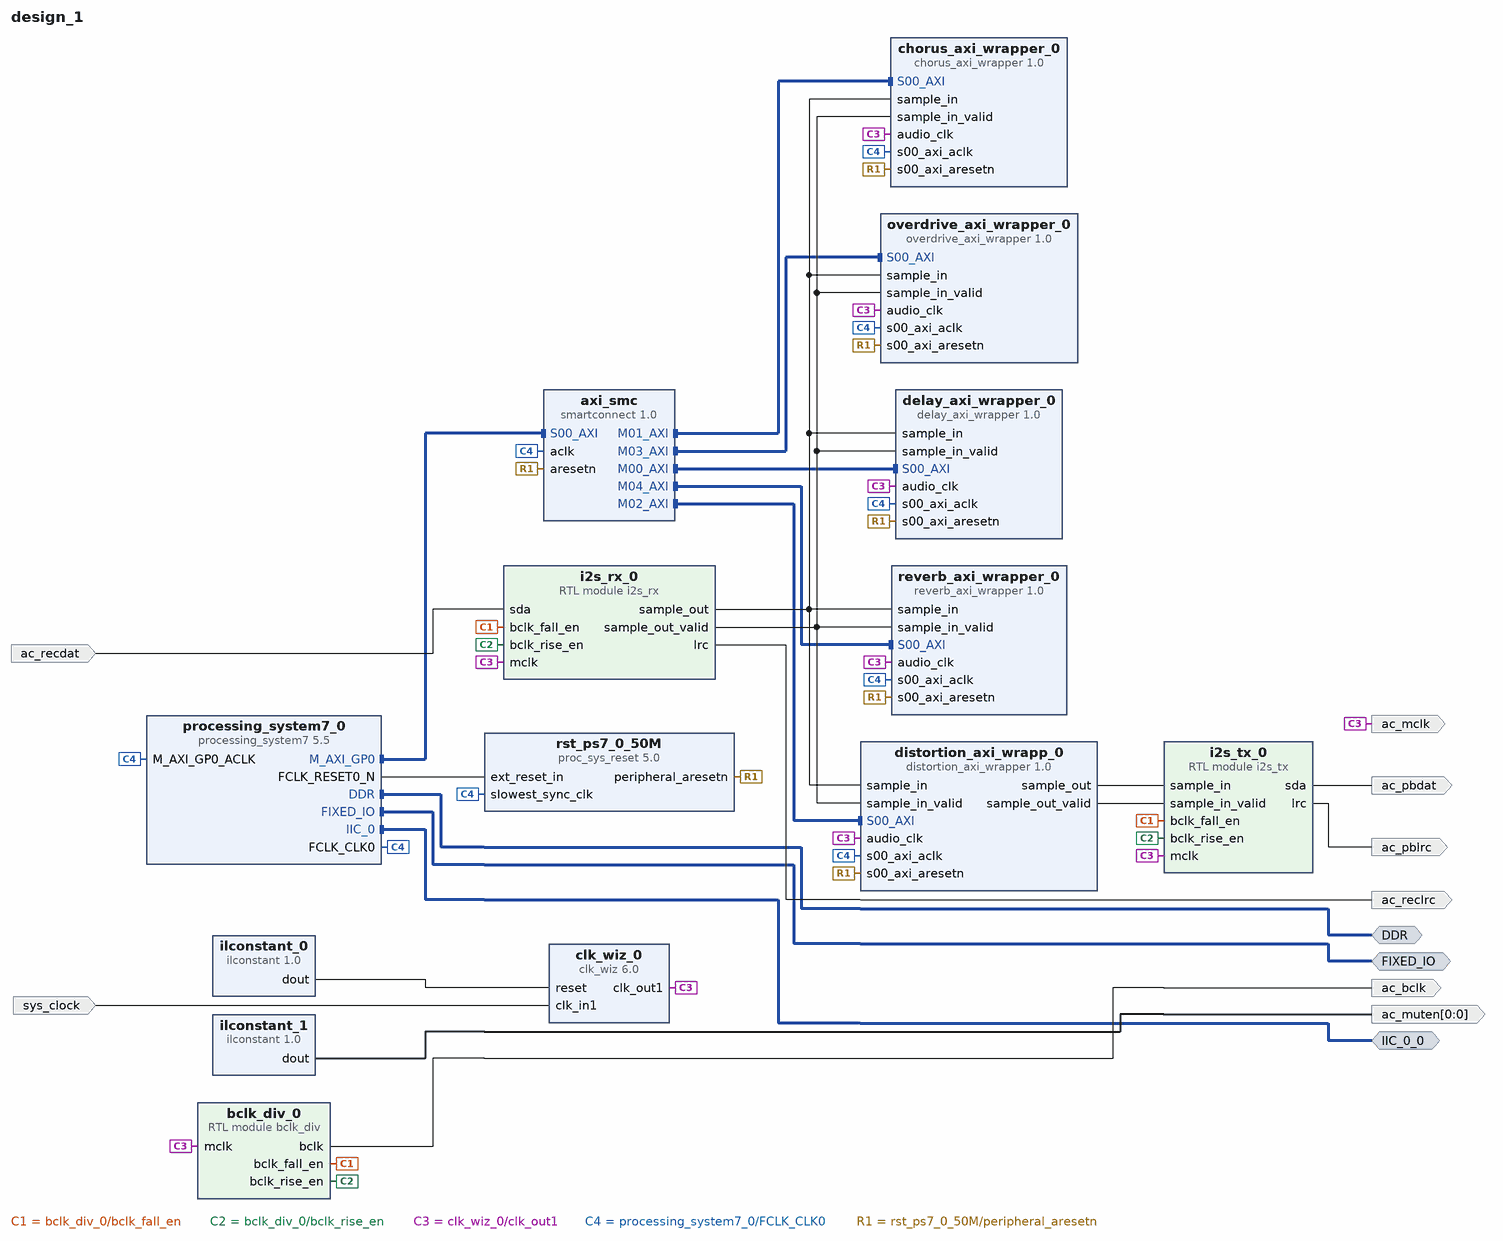
[diagram p0: block diagram of the top level]
# Vivado block design design_1, xc7z010clg400-1, Vivado 2026.1
create_bd_design design_1

create_bd_intf_port -mode Master -vlnv xilinx.com:interface:ddrx_rtl:1.0 DDR
create_bd_intf_port -mode Master -vlnv xilinx.com:display_processing_system7:fixedio_rtl:1.0 FIXED_IO
create_bd_intf_port -mode Master -vlnv xilinx.com:interface:iic_rtl:1.0 IIC_0_0
create_bd_port -dir I -type clk sys_clock
set_property -dict {CONFIG.FREQ_HZ 125000000 CONFIG.PHASE 0.0} [get_bd_ports sys_clock]
create_bd_port -dir O ac_bclk
create_bd_port -dir O ac_pbdat
create_bd_port -dir O ac_pblrc
create_bd_port -dir I ac_recdat
create_bd_port -dir O ac_reclrc
create_bd_port -dir O -type clk ac_mclk
create_bd_port -dir O -from 0 -to 0 ac_muten

create_bd_cell -type ip -vlnv xilinx.com:ip:processing_system7:5.5 processing_system7_0
set_property -dict [list \
  CONFIG.PCW_APU_PERIPHERAL_FREQMHZ 666.666666 \
  CONFIG.PCW_ENET0_ENET0_IO {MIO 16 .. 27} \
  CONFIG.PCW_ENET0_GRP_MDIO_ENABLE 1 \
  CONFIG.PCW_ENET0_GRP_MDIO_IO {MIO 52 .. 53} \
  CONFIG.PCW_ENET0_PERIPHERAL_ENABLE 1 \
  CONFIG.PCW_ENET0_RESET_ENABLE 0 \
  CONFIG.PCW_ENET_RESET_ENABLE 1 \
  CONFIG.PCW_ENET_RESET_SELECT {Share reset pin} \
  CONFIG.PCW_GPIO_MIO_GPIO_ENABLE 1 \
  CONFIG.PCW_GPIO_MIO_GPIO_IO MIO \
  CONFIG.PCW_I2C0_I2C0_IO EMIO \
  CONFIG.PCW_I2C0_PERIPHERAL_ENABLE 1 \
  CONFIG.PCW_I2C_PERIPHERAL_FREQMHZ 111.111115 \
  CONFIG.PCW_I2C_RESET_ENABLE 1 \
  CONFIG.PCW_I2C_RESET_SELECT {Share reset pin} \
  CONFIG.PCW_PRESET_BANK1_VOLTAGE {LVCMOS 1.8V} \
  CONFIG.PCW_QSPI_GRP_FBCLK_ENABLE 1 \
  CONFIG.PCW_QSPI_GRP_FBCLK_IO {MIO 8} \
  CONFIG.PCW_QSPI_GRP_SINGLE_SS_ENABLE 1 \
  CONFIG.PCW_QSPI_GRP_SINGLE_SS_IO {MIO 1 .. 6} \
  CONFIG.PCW_QSPI_PERIPHERAL_ENABLE 1 \
  CONFIG.PCW_QSPI_QSPI_IO {MIO 1 .. 6} \
  CONFIG.PCW_SD0_GRP_CD_ENABLE 1 \
  CONFIG.PCW_SD0_GRP_CD_IO {MIO 47} \
  CONFIG.PCW_SD0_GRP_WP_ENABLE 0 \
  CONFIG.PCW_SD0_PERIPHERAL_ENABLE 1 \
  CONFIG.PCW_SD0_SD0_IO {MIO 40 .. 45} \
  CONFIG.PCW_SDIO_PERIPHERAL_FREQMHZ 50 \
  CONFIG.PCW_SINGLE_QSPI_DATA_MODE x4 \
  CONFIG.PCW_UART1_PERIPHERAL_ENABLE 1 \
  CONFIG.PCW_UART1_UART1_IO {MIO 48 .. 49} \
  CONFIG.PCW_UART_PERIPHERAL_FREQMHZ 100 \
  CONFIG.PCW_UIPARAM_DDR_FREQ_MHZ 533.333333 \
  CONFIG.PCW_UIPARAM_DDR_MEMORY_TYPE {DDR 3 (Low Voltage)} \
  CONFIG.PCW_UIPARAM_DDR_PARTNO {MT41K256M16 RE-125} \
  CONFIG.PCW_USB0_PERIPHERAL_ENABLE 1 \
  CONFIG.PCW_USB0_RESET_ENABLE 1 \
  CONFIG.PCW_USB0_RESET_IO {MIO 46} \
  CONFIG.PCW_USB0_USB0_IO {MIO 28 .. 39} \
  CONFIG.PCW_USB_RESET_ENABLE 1 \
  CONFIG.PCW_USB_RESET_SELECT {Share reset pin} \
] [get_bd_cells processing_system7_0]
# 299 more settings of processing_system7_0 are not shown: defaults, MIO pin electricals, DDR timing, and values the tool derives
create_bd_cell -type ip -vlnv xilinx.com:ip:clk_wiz:6.0 clk_wiz_0
set_property -dict [list \
  CONFIG.CLKOUT1_JITTER 473.813 \
  CONFIG.CLKOUT1_PHASE_ERROR 351.816 \
  CONFIG.CLKOUT1_REQUESTED_OUT_FREQ 12.288 \
  CONFIG.CLK_IN1_BOARD_INTERFACE sys_clock \
  CONFIG.MMCM_CLKFBOUT_MULT_F 42.750 \
  CONFIG.MMCM_CLKOUT0_DIVIDE_F 62.125 \
  CONFIG.MMCM_DIVCLK_DIVIDE 7 \
  CONFIG.USE_BOARD_FLOW true \
] [get_bd_cells clk_wiz_0]
create_bd_cell -type module -reference bclk_div bclk_div_0
create_bd_cell -type module -reference i2s_rx i2s_rx_0
create_bd_cell -type module -reference i2s_tx i2s_tx_0
create_bd_cell -type inline_hdl -vlnv xilinx.com:inline_hdl:ilconstant:1.0 ilconstant_0
set_property -dict {CONFIG.CONST_VAL 0} [get_bd_cells ilconstant_0]
create_bd_cell -type inline_hdl -vlnv xilinx.com:inline_hdl:ilconstant:1.0 ilconstant_1
create_bd_cell -type ip -vlnv xilinx.com:user:delay_axi_wrapper:1.0 delay_axi_wrapper_0
create_bd_cell -type ip -vlnv xilinx.com:ip:smartconnect:1.0 axi_smc
set_property -dict {CONFIG.NUM_MI 5 CONFIG.NUM_SI 1} [get_bd_cells axi_smc]
create_bd_cell -type ip -vlnv xilinx.com:ip:proc_sys_reset:5.0 rst_ps7_0_50M
create_bd_cell -type ip -vlnv xilinx.com:user:chorus_axi_wrapper:1.0 chorus_axi_wrapper_0
create_bd_cell -type ip -vlnv xilinx.com:user:reverb_axi_wrapper:1.0 reverb_axi_wrapper_0
create_bd_cell -type ip -vlnv xilinx.com:user:overdrive_axi_wrapper:1.0 overdrive_axi_wrapper_0
create_bd_cell -type ip -vlnv xilinx.com:user:distortion_axi_wrapper:1.0 distortion_axi_wrapp_0

# ---- connections ----

connect_bd_intf_net [get_bd_intf_pins axi_smc/M00_AXI] [get_bd_intf_pins delay_axi_wrapper_0/S00_AXI]
connect_bd_intf_net [get_bd_intf_pins axi_smc/M01_AXI] [get_bd_intf_pins chorus_axi_wrapper_0/S00_AXI]
connect_bd_intf_net [get_bd_intf_pins axi_smc/M02_AXI] [get_bd_intf_pins distortion_axi_wrapp_0/S00_AXI]
connect_bd_intf_net [get_bd_intf_pins axi_smc/M03_AXI] [get_bd_intf_pins overdrive_axi_wrapper_0/S00_AXI]
connect_bd_intf_net [get_bd_intf_pins axi_smc/M04_AXI] [get_bd_intf_pins reverb_axi_wrapper_0/S00_AXI]
connect_bd_intf_net [get_bd_intf_ports DDR] [get_bd_intf_pins processing_system7_0/DDR]
connect_bd_intf_net [get_bd_intf_ports FIXED_IO] [get_bd_intf_pins processing_system7_0/FIXED_IO]
connect_bd_intf_net [get_bd_intf_ports IIC_0_0] [get_bd_intf_pins processing_system7_0/IIC_0]
connect_bd_intf_net [get_bd_intf_pins processing_system7_0/M_AXI_GP0] [get_bd_intf_pins axi_smc/S00_AXI]
connect_bd_net [get_bd_ports ac_recdat] [get_bd_pins i2s_rx_0/sda]
connect_bd_net [get_bd_pins bclk_div_0/bclk] [get_bd_ports ac_bclk]
connect_bd_net [get_bd_pins bclk_div_0/bclk_fall_en] [get_bd_pins i2s_tx_0/bclk_fall_en] [get_bd_pins i2s_rx_0/bclk_fall_en]
connect_bd_net [get_bd_pins bclk_div_0/bclk_rise_en] [get_bd_pins i2s_rx_0/bclk_rise_en] [get_bd_pins i2s_tx_0/bclk_rise_en]
connect_bd_net [get_bd_pins clk_wiz_0/clk_out1] \
  [get_bd_pins bclk_div_0/mclk] [get_bd_pins i2s_rx_0/mclk] [get_bd_pins i2s_tx_0/mclk] [get_bd_ports ac_mclk] \
  [get_bd_pins chorus_axi_wrapper_0/audio_clk] [get_bd_pins delay_axi_wrapper_0/audio_clk] \
  [get_bd_pins overdrive_axi_wrapper_0/audio_clk] [get_bd_pins distortion_axi_wrapp_0/audio_clk] \
  [get_bd_pins reverb_axi_wrapper_0/audio_clk]
connect_bd_net [get_bd_pins distortion_axi_wrapp_0/sample_out] [get_bd_pins i2s_tx_0/sample_in]
connect_bd_net [get_bd_pins distortion_axi_wrapp_0/sample_out_valid] [get_bd_pins i2s_tx_0/sample_in_valid]
connect_bd_net [get_bd_pins i2s_rx_0/lrc] [get_bd_ports ac_reclrc]
connect_bd_net [get_bd_pins i2s_rx_0/sample_out] \
  [get_bd_pins chorus_axi_wrapper_0/sample_in] [get_bd_pins delay_axi_wrapper_0/sample_in] \
  [get_bd_pins distortion_axi_wrapp_0/sample_in] [get_bd_pins overdrive_axi_wrapper_0/sample_in] \
  [get_bd_pins reverb_axi_wrapper_0/sample_in]
connect_bd_net [get_bd_pins i2s_rx_0/sample_out_valid] \
  [get_bd_pins chorus_axi_wrapper_0/sample_in_valid] [get_bd_pins delay_axi_wrapper_0/sample_in_valid] \
  [get_bd_pins overdrive_axi_wrapper_0/sample_in_valid] [get_bd_pins distortion_axi_wrapp_0/sample_in_valid] \
  [get_bd_pins reverb_axi_wrapper_0/sample_in_valid]
connect_bd_net [get_bd_pins i2s_tx_0/lrc] [get_bd_ports ac_pblrc]
connect_bd_net [get_bd_pins i2s_tx_0/sda] [get_bd_ports ac_pbdat]
connect_bd_net [get_bd_pins ilconstant_0/dout] [get_bd_pins clk_wiz_0/reset]
connect_bd_net [get_bd_pins ilconstant_1/dout] [get_bd_ports ac_muten]
connect_bd_net [get_bd_pins processing_system7_0/FCLK_CLK0] \
  [get_bd_pins processing_system7_0/M_AXI_GP0_ACLK] [get_bd_pins axi_smc/aclk] [get_bd_pins rst_ps7_0_50M/slowest_sync_clk] \
  [get_bd_pins chorus_axi_wrapper_0/s00_axi_aclk] [get_bd_pins delay_axi_wrapper_0/s00_axi_aclk] \
  [get_bd_pins distortion_axi_wrapp_0/s00_axi_aclk] [get_bd_pins overdrive_axi_wrapper_0/s00_axi_aclk] \
  [get_bd_pins reverb_axi_wrapper_0/s00_axi_aclk]
connect_bd_net [get_bd_pins processing_system7_0/FCLK_RESET0_N] [get_bd_pins rst_ps7_0_50M/ext_reset_in]
connect_bd_net [get_bd_pins rst_ps7_0_50M/peripheral_aresetn] \
  [get_bd_pins axi_smc/aresetn] [get_bd_pins chorus_axi_wrapper_0/s00_axi_aresetn] \
  [get_bd_pins delay_axi_wrapper_0/s00_axi_aresetn] [get_bd_pins distortion_axi_wrapp_0/s00_axi_aresetn] \
  [get_bd_pins overdrive_axi_wrapper_0/s00_axi_aresetn] [get_bd_pins reverb_axi_wrapper_0/s00_axi_aresetn]
connect_bd_net [get_bd_ports sys_clock] [get_bd_pins clk_wiz_0/clk_in1]

# ---- address map ----
assign_bd_address -offset 0x43C00000 -range 64K -target_address_space [get_bd_addr_spaces processing_system7_0/Data] [get_bd_addr_segs delay_axi_wrapper_0/S00_AXI/S00_AXI_reg]
assign_bd_address -offset 0x43C10000 -range 64K -target_address_space [get_bd_addr_spaces processing_system7_0/Data] [get_bd_addr_segs chorus_axi_wrapper_0/S00_AXI/S00_AXI_reg]
assign_bd_address -offset 0x43C20000 -range 64K -target_address_space [get_bd_addr_spaces processing_system7_0/Data] [get_bd_addr_segs distortion_axi_wrapp_0/S00_AXI/S00_AXI_reg]
assign_bd_address -offset 0x43C30000 -range 64K -target_address_space [get_bd_addr_spaces processing_system7_0/Data] [get_bd_addr_segs overdrive_axi_wrapper_0/S00_AXI/S00_AXI_reg]
assign_bd_address -offset 0x43C40000 -range 64K -target_address_space [get_bd_addr_spaces processing_system7_0/Data] [get_bd_addr_segs reverb_axi_wrapper_0/S00_AXI/S00_AXI_reg]

validate_bd_design
save_bd_design
